# Altium project buck_boost_synchronous.PrjPcb
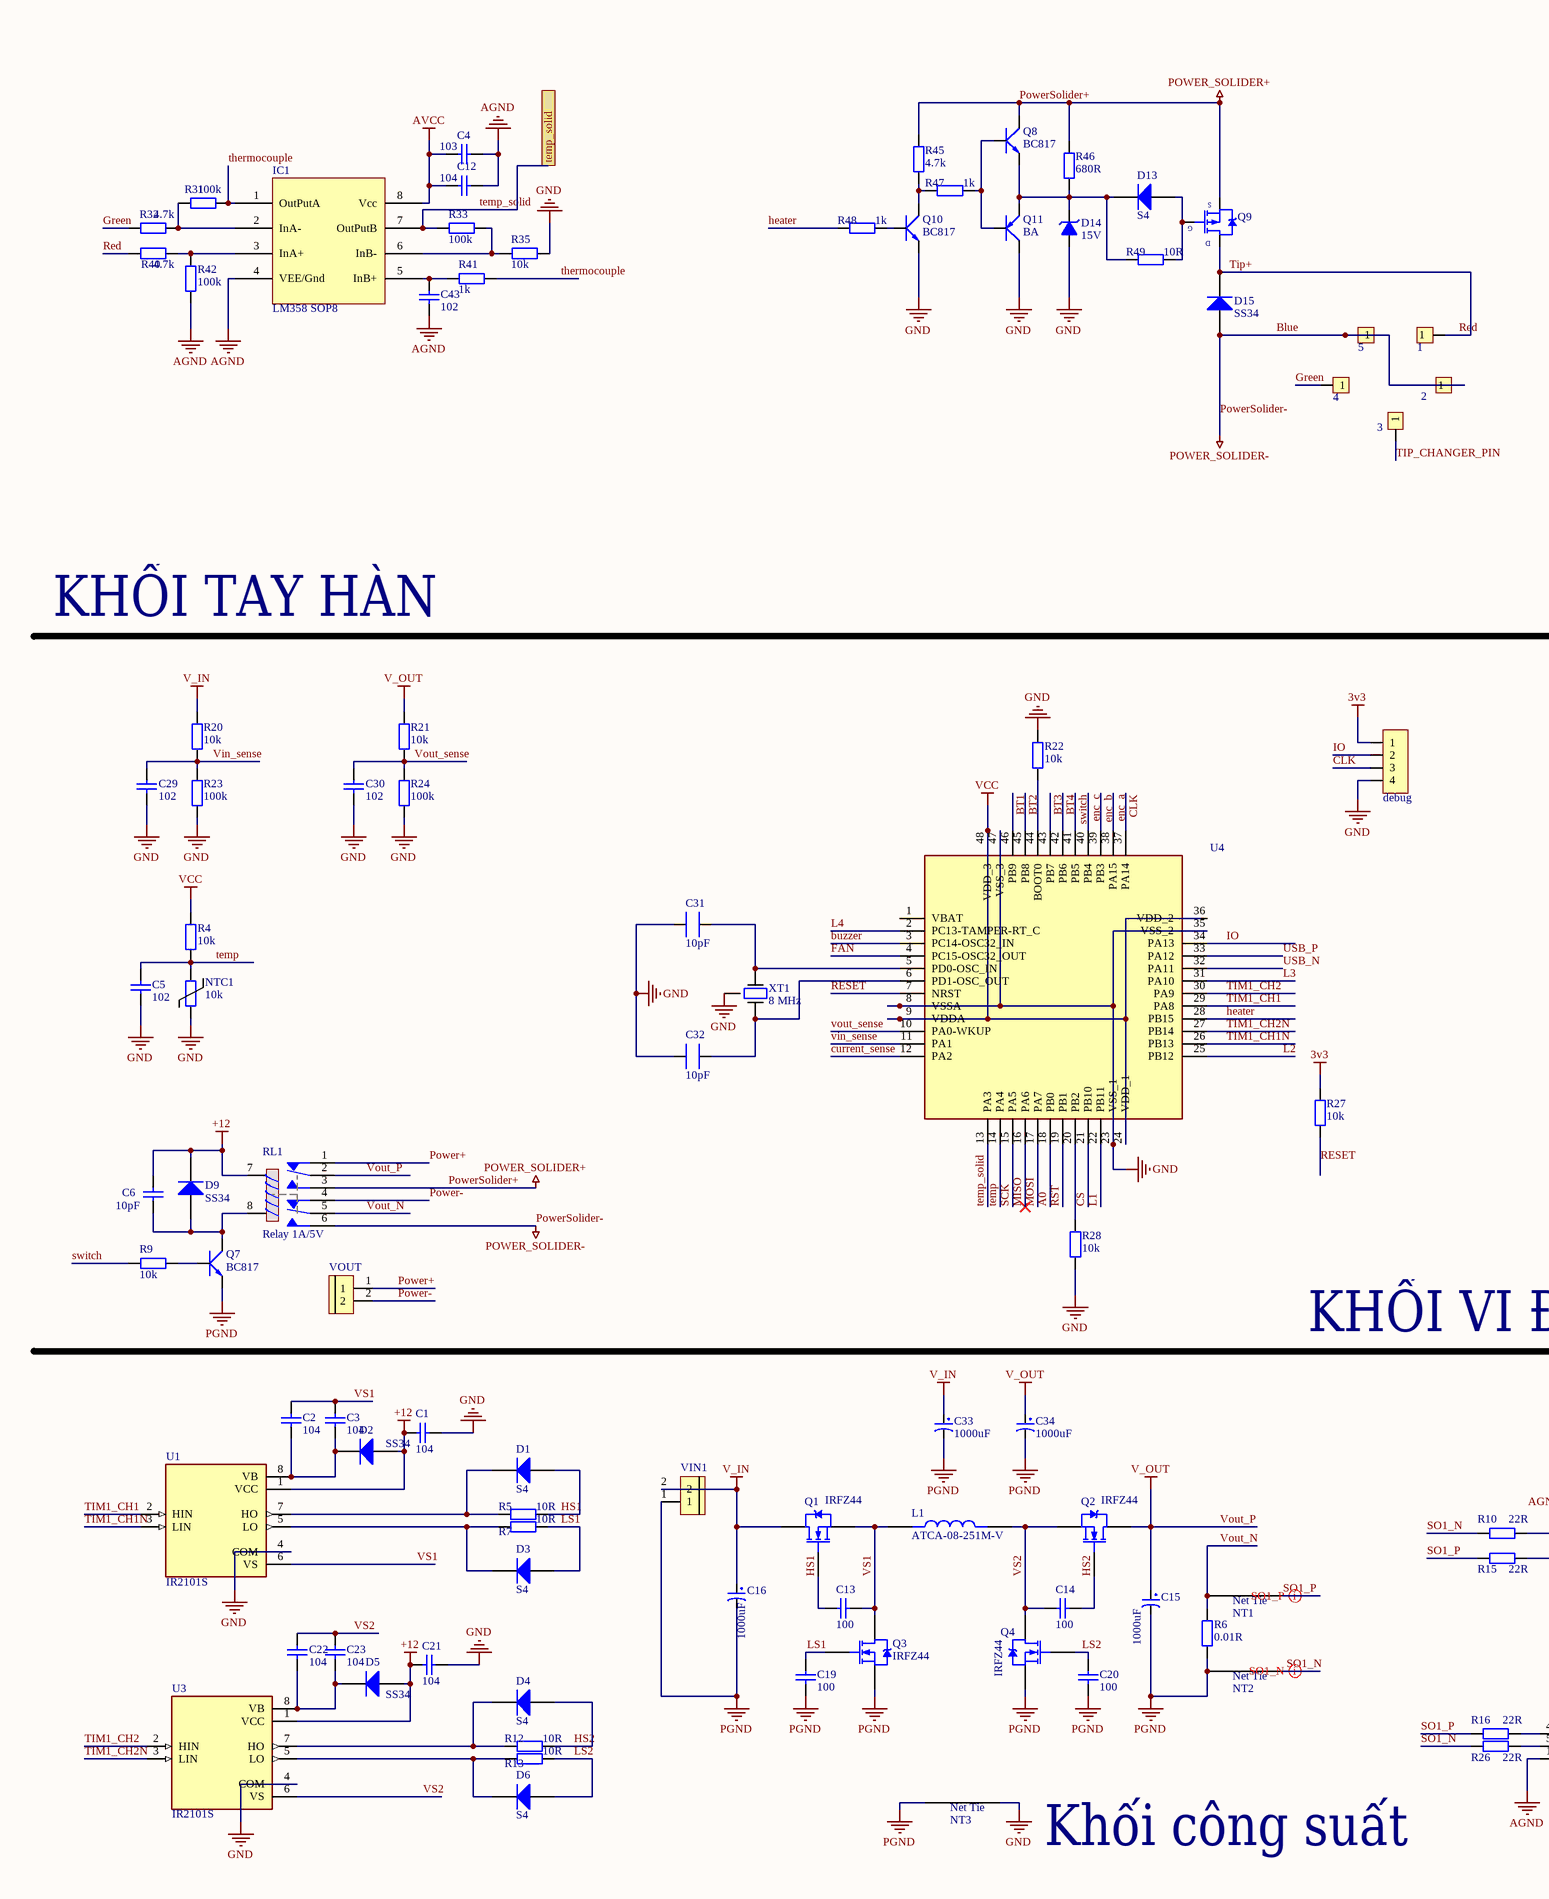
[diagram p0: Sheet2.SchDoc, left]
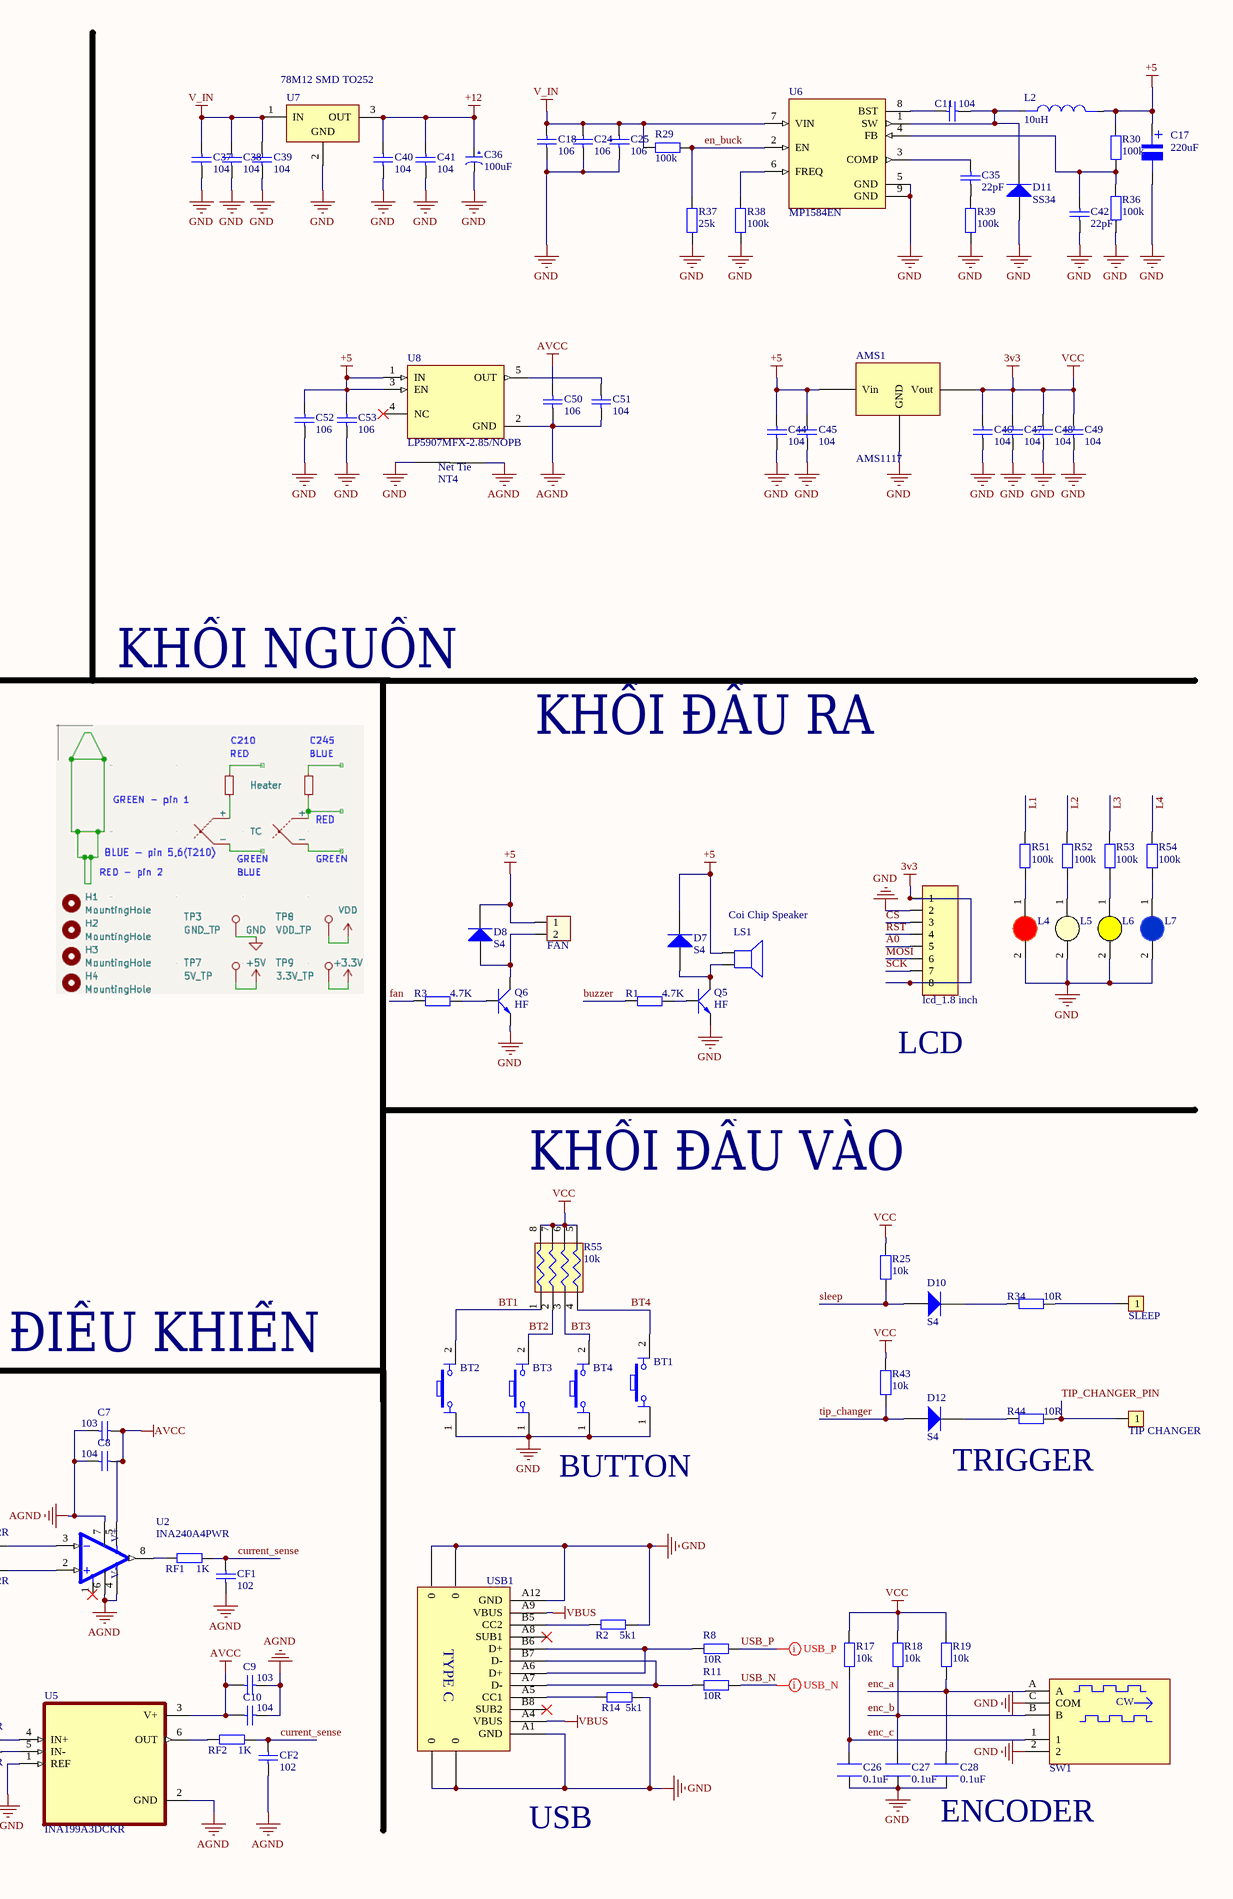
[diagram p1: Sheet2.SchDoc, right]
1 sheet, 179 parts. Net scope: flat (ports and power ports of the same name join across sheets).
Board files: PCB1.PcbDoc, PCB3.PcbDoc

## Sheet Sheet2.SchDoc
size A2; SheetNumber: 1; SheetTotal: 1

### Parts
AMS1  AMS1117  [TO 252]
BT1  Nut Nhan 4 Chan Cam 6x6  [Nut Nhan 4 Chan Cam 6x6]  (value not drawn)
BT2  Nut Nhan 4 Chan Cam 6x6  [Nut Nhan 4 Chan Cam 6x6]  (value not drawn)
BT3  Nut Nhan 4 Chan Cam 6x6  [Nut Nhan 4 Chan Cam 6x6]  (value not drawn)
BT4  Nut Nhan 4 Chan Cam 6x6  [Nut Nhan 4 Chan Cam 6x6]  (value not drawn)
C1  104  [tu 0603]
C2  104  [tu 0603]
C3  104  [tu 0805]
C4  103  [tu 0603]
C5  102  [tu 0603]
C6  10pF  [tu 0805]
C7  103  [tu 0603]
C8  104  [tu 0603]
C9  103  [tu 0603]
C10  104  [tu 0603]
C11  104  [tu 0603]
C12  104  [tu 0603]
C13  100  [tu 0805]
C14  100  [tu 0805]
C15  1000uF  [tu hoa 10mm]
C16  1000uF  [tu hoa 10mm]
C17  220uF  [tu nhom 6.3 (d)]
C18  106  [tu 0805]
C19  100  [tu 0805]
C20  100  [tu 0805]
C21  104  [tu 0603]
C22  104  [tu 0603]
C23  104  [tu 0805]
C24  106  [tu 0805]
C25  106  [tu 0805]
C26  0.1uF  [CAPC1608X09L]
C27  0.1uF  [CAPC1608X09L]
C28  0.1uF  [CAPC1608X09L]
C29  102  [tu 0603]
C30  102  [tu 0603]
C31  10pF  [CAPC1608X09L]
C32  10pF  [CAPC1608X09L]
C33  1000uF  [tu hoa 13mm]
C34  1000uF  [tu hoa 13mm]
C35  22pF  [tu 0805]
C36  100uF  [tu hoa 8mm]
C37  104  [tu 0603]
C38  104  [tu 0603]
C39  104  [tu 0603]
C40  104  [tu 0603]
C41  104  [tu 0603]
C42  22pF  [tu 0805]
C43  102  [tu 0603]
C44  104  [tu 0603]
C45  104  [tu 0603]
C46  104  [tu 0603]
C47  104  [tu 0603]
C48  104  [tu 0603]
C49  104  [tu 0603]
C50  106  [tu 0603]
C51  104  [tu 0603]
C52  106  [tu 0603]
C53  106  [tu 0603]
CF1  102  [tu 0603]
CF2  102  [tu 0603]
D1  S4  [DIODE SOD-123]
D2  SS34  [DIODE SMA]
D3  S4  [DIODE SOD-123]
D4  S4  [DIODE SOD-123]
D5  SS34  [DIODE SMA]
D6  S4  [DIODE SOD-123]
D7  S4  [DIODE SOD-123]
D8  S4  [DIODE SOD-123]
D9  SS34  [DIODE SMA]
D10  S4  [DIODE SOD-123]
D11  SS34  [DIODE SMA]
D12  S4  [DIODE SOD-123]
D13  S4  [DIODE SOD-123]
D14  15V  [DIODE ZENNER SMD SOD80]
D15  SS34  [DIODE SMA]
H1  FAN  [XH2.54M-2]
IC1  LM358 SOP8  [SOP 8]
JP1  debug  [JP 1x4 DT]
JP2  lcd_1.8 inch  [JP 1x8 DT]
JP3  SLEEP  [JP 1x1 DT]
JP4  TIP CHANGER  [JP 1x1 DT]
JP5  5  [JP 1x1 DT]
JP6  1  [JP 1x1 DT]
JP7  4  [JP 1x1 DT]
JP8  2  [JP 1x1 DT]
JP9  3  [JP 1x1 DT]
L1  ATCA-08-251M-V  [IND_ATCA-08-251M-V]
L2  10uH  [CUON CAM SMD 0530]
L4  LED 3mm  [LED-3MM-RED]  (value not drawn)
L5  LED 3mm  [LED-3MM-WHITE]  (value not drawn)
L6  LED 3mm  [LED-3MM-YELLOW]  (value not drawn)
L7  LED 3mm  [LED-3MM-BLUE]  (value not drawn)
LS1  Coi Chip Speaker  [Coi Chip Speacker]
NT1  0.25mm  [NetTie_0.25mm]  (value not drawn)  (net tie, no BOM)
NT2  0.25mm  [NetTie_0.25mm]  (value not drawn)  (net tie, no BOM)
NT3  NetTie_2mm  [NetTie_2mm]  (value not drawn)  (net tie, no BOM)
NT4  2mm  [NetTie_20mil]  (value not drawn)  (net tie, no BOM)
NTC1  10k  [MF52]
Q1  IRFZ44  [QTO-220H3]
Q2  IRFZ44  [QTO-220H3]
Q3  IRFZ44  [QTO-220H3]
Q4  IRFZ44  [QTO-220H3]
Q5  HF  [SOT-23]
Q6  HF  [SOT-23]
Q7  BC817  [SOT-23]
Q8  BC817  [SOT-23]
Q9  IRF4905S  [D2PACK]  (value not drawn)
Q10  BC817  [SOT-23]
Q11  BA  [SOT23]
R1  4.7K  [Tro smd 0603]
R2  5k1  [tro smd 0603]
R3  4.7K  [Tro smd 0603]
R4  10k  [tro smd 0603]
R5  10R  [Tro smd 0603]
R6  0.01R  [tro smd 2512]
R7  10R  [Tro smd 0603]
R8  10R  [Tro smd 0603]
R9  10k  [Tro smd 0603]
R10  22R  [Tro smd 0603]
R11  10R  [Tro smd 0603]
R12  10R  [Tro smd 0603]
R13  10R  [Tro smd 0603]
R14  5k1  [tro smd 0603]
R15  22R  [Tro smd 0603]
R16  22R  [Tro smd 0603]
R17  10k  [Tro smd 0603]
R18  10k  [Tro smd 0603]
R19  10k  [Tro smd 0603]
R20  10k  [tro smd 0603]
R21  10k  [tro smd 0603]
R22  10k  [Tro smd 0603]
R23  100k  [tro smd 0603]
R24  100k  [tro smd 0603]
R25  10k  [Tro smd 0603]
R26  22R  [Tro smd 0603]
R27  10k  [Tro smd 0603]
R28  10k  [Tro smd 0603]
R29  100k  [tro smd 0603]
R30  100k  [tro smd 0603]
R31  100k  [Tro smd 0603]
R32  4.7k  [Tro smd 0603]
R33  100k  [Tro smd 0603]
R34  10R  [Tro smd 0603]
R35  10k  [Tro smd 0603]
R36  100k  [tro smd 0603]
R37  25k  [tro smd 0603]
R38  100k  [tro smd 0603]
R39  100k  [tro smd 0603]
R40  4.7k  [Tro smd 0603]
R41  1k  [Tro smd 0603]
R42  100k  [Tro smd 0603]
R43  10k  [Tro smd 0603]
R44  10R  [Tro smd 0603]
R45  4.7k  [Tro smd 0603]
R46  680R  [tro vach 1/4w]
R47  1k  [Tro smd 0603]
R48  1k  [Tro smd 0603]
R49  10R  [Tro smd 0603]
R51  100k  [tro smd 0603]
R52  100k  [tro smd 0603]
R53  100k  [tro smd 0603]
R54  100k  [tro smd 0603]
R55  10k  [tro bang 0603 4]
RF1  1K  [Tro smd 0603]
RF2  1K  [Tro smd 0603]
RL1  Relay 1A/5V  [Relay 8 Chan HK19F]
SW1  482024764004  [482024764004]  (value not drawn)
U1  IR2101S  [SOIC127P600X175-8N]
U2  INA240A4PWR  [SOP65P640X120-8N]
U3  IR2101S  [SOIC127P600X175-8N]
U4  STM32F103C8T6  [LQFP-48_19.6_393_58X11_SMD]  (value not drawn)
U5  INA199A3DCKR  [SOT65P210X110-6N]
U6  MP1584EN  [SOIC127P600X170-9N]
U7  78M12 SMD TO252  [TO252]
U8  LP5907MFX-2.85/NOPB  [SOT95P280X145-5N]
USB1  Type C 16P  [Type C 16P]  (value not drawn)
VIN1  CON 2 EDG5.08  [CON 2 2EDG5.08]  (value not drawn)
VOUT  CON 2 EDG5.08  [CON 2 2EDG5.08]  (value not drawn)
XT1  8 MHz  [DFN220P320X110-4N]

### Ports
temp_solid

### Nets
3v3: AMS1.2(Vout) C46.1 C47.1 C48.1 C49.1 JP1.1 JP2.1 JP2.8 R4.1 R17.2 R18.2 R19.2 R25.2 R27.2 R43.2 R55.5 R55.6 R55.7 R55.8 U4.9(VDDA) U4.24(VDD_1) U4.48(VDD_3)  [also labelled VCC]
+5: AMS1.3(Vin) C17.1 C44.1 C45.1 C52.1 C53.1 D7.2(K) D8.2(K) H1.1 L2.2 LS1.1 R30.2 U8.1(IN) U8.3(EN)
+12: C1.1 C6.1 C21.1 C36.1 C40.1 C41.1 D2.1(A) D5.1(A) D9.2(K) RL1.7 U1.1(VCC) U3.1(VCC) U7.3(OUT)
AGND: C4.2 C7.1 C8.1 C9.2 C10.2 C12.2 C43.1 C50.2 C51.2 CF1.1 CF2.1 IC1.4(VEE/Gnd) NT4.2 R42.2 U2.4(GND) U2.6(REF2) U2.7(REF1) U5.1(REF) U5.2(GND) U8.2(GND)
AVCC: C4.1 C7.2 C8.2 C9.1 C10.1 C12.1 C50.1 IC1.8(Vcc) U2.5(VS) U5.3(V+)
Blue: D15.1(A) JP5.1 JP8.1 RL1.6  [also labelled POWER_SOLIDER-, PowerSolider-]
GND: AMS1.1(GND) BT1.1 BT2.1 BT3.1 BT4.1 C1.2 C5.1 C17.2 C18.2 C21.2 C24.2 C25.2 C26.1 C27.1 C28.1 C29.1 C30.1 C31.1 C32.1 C36.2 C37.2 C38.2 C39.2 C40.2 C41.2 C42.2 C44.2 C45.2 C46.2 C47.2 C48.2 C49.2 C52.2 C53.2 D11.1(A) D14.1(A) JP1.4 JP2.2 L4.2(K) L5.2(K) L6.2(K) L7.2(K) NT3.2 NT4.1 NTC1.1 Q5.2(E) Q6.2(E) Q10.2(E) Q11.3(C) R2.2 R14.2 R22.2 R23.2 R24.2 R28.1 R35.2 R36.1 R37.1 R38.1 R39.1 SW1.2 SW1.C(COM) U1.4(COM) U3.4(COM) U4.8(VSSA) U4.23(VSS_1) U4.35(VSS_2) U4.47(VSS_3) U6.5(GND) U6.9(GND) U7.2(GND) USB1.0 USB1.A1(GND) USB1.A12(GND) XT1.G
PGND: C15.2 C16.2 C19.2 C20.2 C33.2 C34.2 NT2.1 NT3.1 Q3.3(S) Q4.3(S) Q7.2(E) R6.1 VIN1.1
PowerSolider+: Q8.3(C) Q9.3(S) R45.2 R46.2 RL1.3  [also labelled POWER_SOLIDER+]
V_IN: C16.1 C18.1 C24.1 C25.1 C33.1 C37.1 C38.1 C39.1 Q1.2(D) R20.1 R29.2 U6.7(VIN) U7.1(IN) VIN1.2
VBUS: USB1.A4(VBUS) USB1.A9(VBUS)
Vout_P: C15.1 C34.1 Q2.2(D) R21.1 RL1.2  [also labelled V_OUT]
A0: JP2.5 U4.18(PB0)
BT1: BT2.2 R55.1 U4.46(PB9)
BT2: BT3.2 R55.2 U4.45(PB8)
BT3: BT4.2 R55.3 U4.43(PB7)
BT4: BT1.2 R55.4 U4.42(PB6)
buzzer: R1.1 U4.3(PC14-OSC32_IN)
CLK: JP1.3 U4.37(PA14)
CS: JP2.3 U4.21(PB10)
current_sense: CF1.2 CF2.2 RF1.2 RF2.2 U4.12(PA2)
en_buck: R29.1 R37.2 U6.2(EN)
enc_a: C28.2 R19.1 SW1.A U4.38(PA15)
enc_b: C27.2 R18.1 SW1.B U4.39(PB3)
enc_c: C26.2 R17.1 SW1.1 U4.40(PB4)
FAN: R3.1 U4.4(PC15-OSC32_OUT)
Green: JP7.1 R32.2
heater: R48.1 U4.28(PB15)
HS1: C13.2 D1.1(A) Q1.1(G) R5.2
HS2: C14.1 D4.1(A) Q2.1(G) R12.2
IO: JP1.2 U4.34(PA13)
L1: R51.1 U4.22(PB11)
L2: R52.1 U4.25(PB12)
L3: R53.1 U4.31(PA10)
L4: R54.1 U4.2(PC13-TAMPER-RT_C)
LS1: C19.1 D3.1(A) Q3.1(G) R7.2
LS2: C20.1 D6.1(A) Q4.1(G) R13.2
MISO: U4.16(PA6)
MOSI: JP2.6 U4.17(PA7)
Power+: RL1.1 VOUT.1
Power-: RL1.4 VOUT.2
Red: D15.2(K) JP6.1 Q9.2(D) R40.2  [also labelled Tip+]
RESET: R27.1 U4.7(NRST)
RST: JP2.4 U4.19(PB1)
SCK: JP2.7 U4.15(PA5)
sleep: D10.1(A) R25.1
SO1_N: NT2.2 R10.1 R26.1
SO1_P: NT1.2 R15.1 R16.1
switch: R9.2 U4.41(PB5)
temp: C5.2 NTC1.2 R4.2 U4.14(PA4)
temp_solid: IC1.7(OutPutB) R33.1 U4.13(PA3) ; port temp_solid
thermocouple: IC1.1(OutPutA) R31.2 R41.1
TIM1_CH1: U1.2(HIN) U4.29(PA8)
TIM1_CH1N: U1.3(LIN) U4.26(PB13)
TIM1_CH2: U3.2(HIN) U4.30(PA9)
TIM1_CH2N: U3.3(LIN) U4.27(PB14)
tip_changer: D12.1(A) R43.1
TIP_CHANGER_PIN: JP4.1 JP9.1 R44.2
USB_N: R11.2 U4.32(PA11)
USB_P: R8.2 U4.33(PA12)
vin_sense: C29.2 R20.2 R23.1 U4.11(PA1)
Vout_N: NT1.1 R6.2 RL1.5
Vout_sense: C30.2 R21.2 R24.1 U4.10(PA0-WKUP)
VS1: C2.2 C3.1 C13.1 L1.1 Q1.3(S) Q3.2(D) U1.6(VS)
VS2: C14.2 C22.1 C23.1 L1.2 Q2.3(S) Q4.2(D) U3.6(VS)
NetC2_1: C2.1 C3.2 D2.2(K) U1.8(VB)
NetC6_2: C6.2 D9.1(A) Q7.3(C) RL1.8
NetC11_1: C11.1 D11.2(K) L2.1 U6.1(SW)
NetC11_2: C11.2 U6.8(BST)
NetC22_2: C22.2 C23.2 D5.2(K) U3.8(VB)
NetC31_2: C31.2 U4.5(PD0-OSC_IN) XT1.1
NetC32_2: C32.2 U4.6(PD1-OSC_OUT) XT1.3
NetC35_1: C35.1 U6.3(COMP)
NetC35_2: C35.2 R39.2
NetC42_1: C42.1 R30.1 R36.2 U6.4(FB)
NetC43_2: C43.2 IC1.5(InB+) R41.2
NetC51_1: C51.1 U8.5(OUT)
NetD1_2: D1.2(K) R5.1 U1.7(HO)
NetD3_2: D3.2(K) R7.1 U1.5(LO)
NetD4_2: D4.2(K) R12.1 U3.7(HO)
NetD6_2: D6.2(K) R13.1 U3.5(LO)
NetD7_1: D7.1(A) LS1.2 Q5.3(C)
NetD8_1: D8.1(A) H1.2 Q6.3(C)
NetD10_2: D10.2(K) R34.1
NetD12_2: D12.2(K) R44.1
NetD13_1: D13.1(A) Q9.1(G) R49.2
NetD13_2: D13.2(K) D14.2(K) Q8.2(E) Q11.2(E) R46.1 R49.1
NetIC1_2: IC1.2(InA-) R31.1 R32.1
NetIC1_3: IC1.3(InA+) R40.1 R42.1
NetIC1_6: IC1.6(InB-) R33.2 R35.1
NetJP3_1: JP3.1 R34.2
NetL4_1: L4.1(A) R51.2
NetL5_1: L5.1(A) R52.2
NetL6_1: L6.1(A) R53.2
NetL7_1: L7.1(A) R54.2
NetQ5_1: Q5.1(B) R1.2
NetQ6_1: Q6.1(B) R3.2
NetQ7_1: Q7.1(B) R9.1
NetQ8_1: Q8.1(B) Q11.1(B) R47.2
NetQ10_1: Q10.1(B) R48.2
NetQ10_3: Q10.3(C) R45.1 R47.1
NetR2_1: R2.1 USB1.B5(CC2)
NetR8_1: R8.1 USB1.A6(D+) USB1.B6(D+)
NetR10_2: R10.2 U2.3(IN-)
NetR11_1: R11.1 USB1.A7(D-) USB1.B7(D-)
NetR14_1: R14.1 USB1.A5(CC1)
NetR15_2: R15.2 U2.2(IN+)
NetR16_2: R16.2 U5.4(IN+)
NetR22_1: R22.1 U4.44(BOOT0)
NetR26_2: R26.2 U5.5(IN-)
NetR28_2: R28.2 U4.20(PB2)
NetR38_2: R38.2 U6.6(FREQ)
NetRF1_1: RF1.1 U2.8(OUT)
NetRF2_1: RF2.1 U5.6(OUT)

Not connected (* = marked no-connect by the designer): U2 1(NC)*; U4 1(VBAT) 36(VDD_2); U8 4(NC)*; USB1 A8(SUB1)* B8(SUB2)*

### Layout directives
differential pair: SO1_N, SO1_P, USB_N, USB_P

### Notes on the sheet
- KHỐI TAY HÀN
- KHỐI NGUỒN
- KHỐI ĐẦU RA
- (near JP2) LCD
- KHỐI ĐẦU VÀO
- KHỐI VI ĐIỀU KHIỂN
- BUTTON
- TRIGGER
- Khối công suất
- USB
- (near C28) ENCODER
- (in symbol 482024764004) CW
- (in symbol INA240A4PWR) V+; V-
- (in symbol NetTie_0.25mm) Net Tie
- (in symbol NetTie_2mm) Net Tie
- (in symbol Tu Nhom 220uF 16V) +
- (in symbol Type C 16P) TYPE C

### Library data of the parts
BT1-BT4 = Nut Nhan 4 Chan Cam 6x6: Nut Nhan 4 Chan 6x6mm; Ten: Nút Nhấn 4 Chân 6x6x5MM DIP; Ma_Hang: MH004584
C1 C2 C21 C22 C37-C41 C44-C49 = Tu 0603 101 50V 10%: Dán; Don_Vi: Con; So_Chan: 2; Ten_Linh_Kien: Tụ 0603 101-0.1nF 10% 50V; Ma_Hang: MH004565; Chung_Loai: Dán; Kieu_Chan: *
C3 C6 C23 = Tu 0805 101 50V 20%: Dán; Don_Vi: Con; So_Chan: 2; Ten_Linh_Kien: Tụ 0805 101-0.1nF 50V 20%; Ma_Hang: MH002806; Chung_Loai: Dán; Kieu_Chan: *
C4 C7-C10 C12 C43 C50-C53 CF1 CF2 = Tu 0603 106 16V 20%: Dán; Don_Vi: Con; So_Chan: 2; Ten_Linh_Kien: Tụ 0603-10uF 20% 16V; Ma_Hang: MH004848; Chung_Loai: Dán; Kieu_Chan: *
C5 C11 C29 C30 = Tu 0603 104 50V 10%: Dán; Don_Vi: Con; So_Chan: 2; Ten_Linh_Kien: Tụ 0603 104-100nF 10% 50V; Ma_Hang: MH004568; Chung_Loai: Dán; Kieu_Chan: *
C13 C14 C19 C20 = Tu 0805 104 50V 10%: Dán; Don_Vi: Con; So_Chan: 2; Ten_Linh_Kien: Tụ 0805 104-100nF 10% 50V; Ma_Hang: MH004551; Chung_Loai: Dán; Kieu_Chan: *
C15 C16 = Tu Hoa 1000uF 10V 10x12: Cắm; So_Chan: 2; Don_Vi: Con; Ten_Linh_Kien: Tụ Hóa 1000uF 10V 10x12MM; Ma_Hang: MH006614; Kieu_Chan: *; Chung_Loai: Cắm
C17 = Tu Nhom 220uF 16V: Dán; Don_Vi: Con; So_Chan: 2; Ten_Linh_Kien: Tụ Nhôm 220uF 16V 6.3x7.7MM; Ma_Hang: MH002227; Chung_Loai: Dán; Kieu_Chan: *
C18 C24 C25 C35 C42 = Tu 0805 106 16V 10%: Dán; Ten_Linh_Kien: Tụ 0805 106-10uF 10% 16V; So_Chan: 2; Don_Vi: Con; Ma_Hang: MH004553; Chung_Loai: Dán; Kieu_Chan: *
C26-C28 C31 C32 = GRM188R71H104KA93D: CAP CER 0.1UF 50V X7R 0603; Manufacturer: Murata Electronics North America; Tolerance: ±10%; Supplier 1: Digi-Key; Supplier Part Number 1: 490-1519-2-ND; Manufacturer Part Number: GRM188R71H104KA93D; RoHS: RoHS Compliant; Category: Capacitors; Pricing 1: 4000=0.01822, 8000=0.01663, 12000=0.01584 (USD); Packaging: Tape & Reel (TR); Capacitance: 0.1uF; Voltage - Rated: 50V; Temperature Coefficient: X7R; Mounting Type: Surface Mount, MLCC; Operating Temperature: -55°C ~ 125°C; Applications: General Purpose; Ratings: -; Package / Case: 0603 (1608 Metric); Size / Dimension: 0.063" L x 0.032" W (1.60mm x 0.80mm); Height - Seated (Max): -; Thickness (Max): 0.035" (0.90mm); Lead Spacing: -; Features: -; Lead Style: -; ComponentLink1URL: http://www.murata.com/~/media/webrenewal/support/library/catalog/products/capacitor/mlcc/c02e.ashx?la=en-us; ComponentLink1Description: http://www.murata.com/~/media/webrenewal/support/library/catalog/products/capacitor/mlcc/c02e.ashx?la=en-us; Stock: 19812000; Part Status: Active; Supplier 2: Digi-Key; Supplier Part Number 2: 490-1519-1-ND; Pricing 2: 1=0.12, 10=0.084, 100=0.0396, 500=0.02778, 1000=0.023 (USD)
C33 C34 = Tu Hoa 1000uF 50V 13x26: Cắm; Don_Vi: Con; So_Chan: 2; Ten_Linh_Kien: Tụ Hóa 1000uF 50V; Ma_Hang: MH006619; Chung_Loai: Cắm; Kieu_Chan: *
C36 = Tu Hoa 100uF 35V 8x11: Cắm; Don_Vi: Con; So_Chan: 2; Ten_Linh_Kien: Tụ Hóa 100uF 35V 8x11MM; Ma_Hang: MH002807; Chung_Loai: Cắm; Kieu_Chan: *
D1 D3 D4 D6-D8 D10 D12 D13 = Diode S4: Dán; Ten_Linh_Kien: Diode S4 SOD123 ( 1N5819 SOD123); Ma_Hang: MH005519; Don_Vi: Con; Ghi_Chu: *; Chung_Loai: Dán; Kieu_Chan: *
D2 D5 D9 D11 D15 = Diode SS34 ( 1N5822 ): Dán; Don_Vi: Con; Ma_Hang: MH002104; Ten_Linh_Kien: Diode SS34 3A 40V SMA ( 1N5822 SS34A); Kieu_Chan: *; Chung_Loai: Dán
D14 = Diode Zener 15V: Dán; Don_Vi: Con; Ma_Hang: MH002883; Ten_Linh_Kien: Diode Zener 1/2W 15V SMD1206 ZMM15; Ghi_Chu: *; Chung_Loai: Dán; Kieu_Chan: *
H1 = Header 2P 2.54 Duc Thang: Cắm; Ten_Linh_Kien: Header 2P XH2.54-2P Đực Thẳng; Don_Vi: Con; Ma_Hang: MH001283; Chung_Loai: Cắm
IC1 = LM358 SOP8: Dán; Ma_Hang: MH000609; Don_Vi: Con; Ten_Linh_Kien: LM358 SOP8; Kieu_Chan: *; Ghi_Chu: *; Chung_Loai: Dán
JP1 = JP 1x4 2.54 Duc Thang: Cắm; Ten_Linh_Kien: Jump Đơn Đực 2.54MM 1x40P Thẳng 11MM; Don_Vi: Con; Ma_Hang: MH000903; Ghi_Chu: *; Kieu_Chan: *; Chung_Loai: Cắm
JP2 = JP 1x8 2.54 Duc Thang: Cắm; Ten_Linh_Kien: Jump Đơn Đực 2.54MM 1x40P Thẳng 11MM; Don_Vi: Con; Ma_Hang: MH000903; Ghi_Chu: *; Kieu_Chan: *; Chung_Loai: Cắm
JP3-JP9 = JP 1x1 2.54 Duc Cong: Cắm; Ten_Linh_Kien: Jump Đơn Đực 2.54MM 1x40P Cong Đứng; Don_Vi: Con; Ma_Hang: MH000904; Ghi_Chu: *; Kieu_Chan: *; Chung_Loai: Cắm
L1 = ATCA-08-251M-V: 250 ÂµH Unshielded Toroidal Inductor 10 A 27mOhm Max Radial, Vertical (Open); MF: Abracon LLC; SnapEDA_Link: https://www.snapeda.com/parts/ATCA-08-251M-V/Abracon/view-part/?ref=snap; Package: Package; Value: *; MP: ATCA-08-251M-V; Check_prices: https://www.snapeda.com/parts/ATCA-08-251M-V/Abracon/view-part/?ref=eda
L2 = Cuon Cam SMD 0530: SMD 0530; MP: FDV0530-H-1R5M=P3; Package: None; Price: None; Value: *; Availability: Unavailable
L4 = LED 3mm Do: Cắm; Don_Vi: Con; Ma_Hang: MH003892; Ten_Linh_Kien: Led 3MM Phủ Đỏ (10c); Ghi_Chu: *; Kieu_Chan: *; Chung_Loai: Cắm
L5 = LED 3mm Trang: Cắm; Don_Vi: Con; Ma_Hang: MH009001; Ten_Linh_Kien: LED 3MM Trắng SS (1000c); Ghi_Chu: *; Kieu_Chan: *; Chung_Loai: Cắm
L6 = LED 3mm Vang: Cắm; Don_Vi: Con; Ma_Hang: MH003893; Ten_Linh_Kien: Led 3MM Phủ Vàng (10c); Ghi_Chu: *; Kieu_Chan: *; Chung_Loai: Cắm
L7 = LED 3mm Xanh Duong: Cắm; Don_Vi: Con; Ma_Hang: MH009003; Ten_Linh_Kien: LED 3MM Xanh Dương SS (1000c); Ghi_Chu: *; Kieu_Chan: *; Chung_Loai: Cắm
LS1 = Coi Chip Speaker: Còi chip
NT1 NT2 = NetTie_0.25mm
NT4 = NetTie_2mm
NTC1 = NCP15XH103F03RC: THERMISTOR 10K OHM NTC 0402 SMD
Q1-Q4 = IRFZ44: HEXFET N-Channel Power MOSFET
Q5 Q6 = Trans C1815 HF SMD: SOT-23; Value: C9014
Q7 Q8 Q10 = Trans BC817: SOT-23 - C8658; Value: C9014
Q9 = IRF4905S: 55V 75A
Q11 = Trans A1015 BA SMD: PNP 600mW, ECB
R1 R3 R5 R7-R13 R15-R19 R22 R25-R28 R31-R35 R40-R45 R47-R49 RF1 RF2 = Tro 0603 5% 10R: Dán; So_Chan: 2; Ten_Linh_Kien: Trở 0603 5% 10R; Ma_Hang: MH006317; Don_Vi: Con; Chung_Loai: Dán; Kieu_Chan: *
R2 R14 = Tro 0603 5% 51k: Dán; Don_Vi: Con; So_Chan: 2; Ten_Linh_Kien: Trở 0603 5% 51k; Ma_Hang: MH007666; Chung_Loai: Dán; Kieu_Chan: *
R4 R20 R21 R23 R24 R51-R54 = Tro 0603 5% 10k: Dán; Don_Vi: Con; So_Chan: 2; Ten_Linh_Kien: Trở 0603 5% 10k; Ma_Hang: MH006316; Chung_Loai: Dán; Kieu_Chan: *
R6 = Tro 2512 1% 0.01R: Dán; Don_Vi: Con; So_Chan: 2; Ten_Linh_Kien: Trở 2512 1% R010-0.01R 1W; Ma_Hang: MH004912; Chung_Loai: Dán; Kieu_Chan: *
R29 R30 R36-R39 = Tro 0603 1% 0R: Dán; Don_Vi: Con; So_Chan: 2; Ten_Linh_Kien: Trở 0603 1% 0R; Ma_Hang: MH005792; Chung_Loai: Dán; Kieu_Chan: *
R46 = Tro Vach 1/4W 5% 680R: Cắm; Don _Vi: Con; So_Chan: 2; Ten_Linh_Kien: Trở Vạch 1/4w 5% 680R; Ma_Hang: MH007331; Chung_Loai: Cắm; Kieu_Chan: *
R55 = Tro bang 0603 100k: Dán; Don_Vi: Con; So_Chan: 8; Ten_Linh_Kien: Trở băng 0603x4 100k; Ma_Hang: MH001451; Chung_Loai: Dán; Kieu_Chan: *
RL1 = Relay 8 Chan HK19F: Ten: Relay 5V1A 8 Chân HK19F-DC05V-SHG; Ma_Hang: MH001504
SW1 = 482024764004: WS-ENTV Mechanical Incremental Encoder Switch, Plastic Shaft without bushing, 24Pulse/360°, 24positi; Manufacturer: Wurth Elektronik; Operation Force: 300g; Detent: 24positions; Electrical Life Encoder: 30000Cycles; Electrical Life Switch: 20000Cycles; Insulation Resistance: 100MΩ; Rated Current: 10mA; ComponentLink1Description: Website Link; ComponentLink1URL: https://www.we-online.com/redexpert/article/482024764004?ad; ComponentLink2Description: Datasheet Link; ComponentLink2URL: https://www.we-online.com/redexpert/spec/482024764004?ad; Manufacturer Part Number: 482024764004; Category: Encoder Switches; Match Code: WS-ENTV; Mount: Through Hole; Operating Temperature Max: 85°C; Operating Temperature Min: -40°C; Packaging: Tray; Length: 13.2mm; Width: 12.4mm; Height: 20mm; Resolution: 24Pulse/360°
U1 U3 = IR2101S: Half-Bridge Gate Driver IC Non-Inverting 8-SOIC; MF: Infineon Technologies; SnapEDA_Link: https://www.snapeda.com/parts/IR2101S/Infineon/view-part/?ref=snap; Package: SOIC-8 Infineon; Value: *; MP: IR2101S; Check_prices: https://www.snapeda.com/parts/IR2101S/Infineon/view-part/?ref=eda
U2 = INA240A4PWR: -4 to 80V, bidirectional, ultra-precise current sense amplifier with enhanced PWM rejection; MF: Texas Instruments; SnapEDA_Link: https://www.snapeda.com/parts/INA240A4PWR/Texas+Instruments/view-part/?ref=snap; Package: TSSOP-8 Texas Instruments; Value: *; MP: INA240A4PWR; Check_prices: https://www.snapeda.com/parts/INA240A4PWR/Texas+Instruments/view-part/?ref=eda
U4 = IC_STM32F103C8T6: ARM® Cortex®-M3 STM32F1 Microcontroller IC 32-Bit 72MHz 64KB (64K x 8) FLASH 48-LQFP (7x7); Manufacturer: STMicroelectronics; Alternate Part Number-1: NA; Manufacturer Part Number: STM32F103C8T6; Case/Package: LQFP48; Supplier-1: LCSC; Supplier Part Number-1: STM32F103C8T6
U5 = INA199A3DCKR: 26V, bi-directional current sense amplifier; MF: Texas Instruments; SnapEDA_Link: https://www.snapeda.com/parts/INA199A3DCKR/Texas+Instruments/view-part/?ref=snap; Package: SOT-SC70-6 Texas Instruments; Value: *; MP: INA199A3DCKR; Check_prices: https://www.snapeda.com/parts/INA199A3DCKR/Texas+Instruments/view-part/?ref=eda
U6 = MP1584EN: Buck Switching Regulator IC Positive Adjustable 0.8V 1 Output 3A 8-SOIC (0.154, 3.90mm Width) Exposed Pad; MF: Monolithic Power; SnapEDA_Link: https://www.snapeda.com/parts/MP1584EN/Monolithic+Power+Systems/view-part/?ref=snap; Package: SOIC-8 Monolithic Power; Value: *; MP: MP1584EN; Check_prices: https://www.snapeda.com/parts/MP1584EN/Monolithic+Power+Systems/view-part/?ref=eda
U7 = 78M05 SMD TO252: Dán; Don_Vi: Con; Ten_Linh_Kien: 78M05 TO252; Ma_Hang: MH001917; Ghi_Chu: *; Kieu_Chan: *; Chung_Loai: Dán
U8 = LP5907MFX-2.85/NOPB: 250-mA, low-noise, high-PSRR, ultra-low-dropout voltage regulator with low IQ and enable; MF: Texas Instruments; SnapEDA_Link: https://www.snapeda.com/parts/LP5907MFX-2.85/NOPB/Texas+Instruments/view-part/?ref=snap; Package: SOT-23-5 Texas Instruments; Value: *; MP: LP5907MFX-2.85/NOPB; Check_prices: https://www.snapeda.com/parts/LP5907MFX-2.85/NOPB/Texas+Instruments/view-part/?ref=eda
VIN1 VOUT = CON 2 EDG5.08: Cắm; Ten_Linh_Kien: CON 2 2EDG5.08-2P 5.08MM ( Xanh Cong); Ma_Hang: MH000759; Ghi_Chu: *; Don_Vi: Con; Kieu_Chan: *; Chung_Loai: Cắm
XT1 = ABM3B-8.000MHZ-10-1-U-T: Crystal 8MHz ±10ppm 10pF 200 Ohm -10°C ~ 60°C Surface Mount 4-SMD, No Lead (DFN, LCC); Manufacturer: Abracon LLC; Operating Mode: Fundamental; Value: 8 MHz; Supplier 1: Digi-Key; Supplier Part Number 1: 535-9721-1-ND; RoHS: RoHS Compliant; Category: Crystals, Oscillators, Resonators; Stock: 35437; Pricing 1: 1=0.69, 10=0.578, 50=0.5198, 100=0.462, 500=0.4389 (USD); Packaging: Cut Tape (CT); Part Status: Active; Type: MHz Crystal; Frequency Stability: ±10ppm; Frequency Tolerance: ±10ppm; Load Capacitance: 10pF; Operating Temperature: -10°C ~ 60°C; Ratings: -; Mounting Type: Surface Mount; Package / Case: 4-SMD, No Lead; Size / Dimension: 0.197" L x 0.126" W (5.00mm x 3.20mm); Height - Seated (Max): 0.043" (1.10mm); ComponentLink1URL: http://www.abracon.com/Resonators/abm3b.pdf; ComponentLink1Description: http://www.abracon.com/Resonators/abm3b.pdf; Supplier 2: Digi-Key; Supplier Part Number 2: 535-9721-2-ND; Pricing 2: 1000=0.336, 3000=0.315, 5000=0.3045, 10000=0.294 (USD); Manufacturer Part Number: ABM3B-8.000MHZ-10-1-U-T